# EAGLE design AmbaSat-02-STS21 (EAGLE 9.5.1)
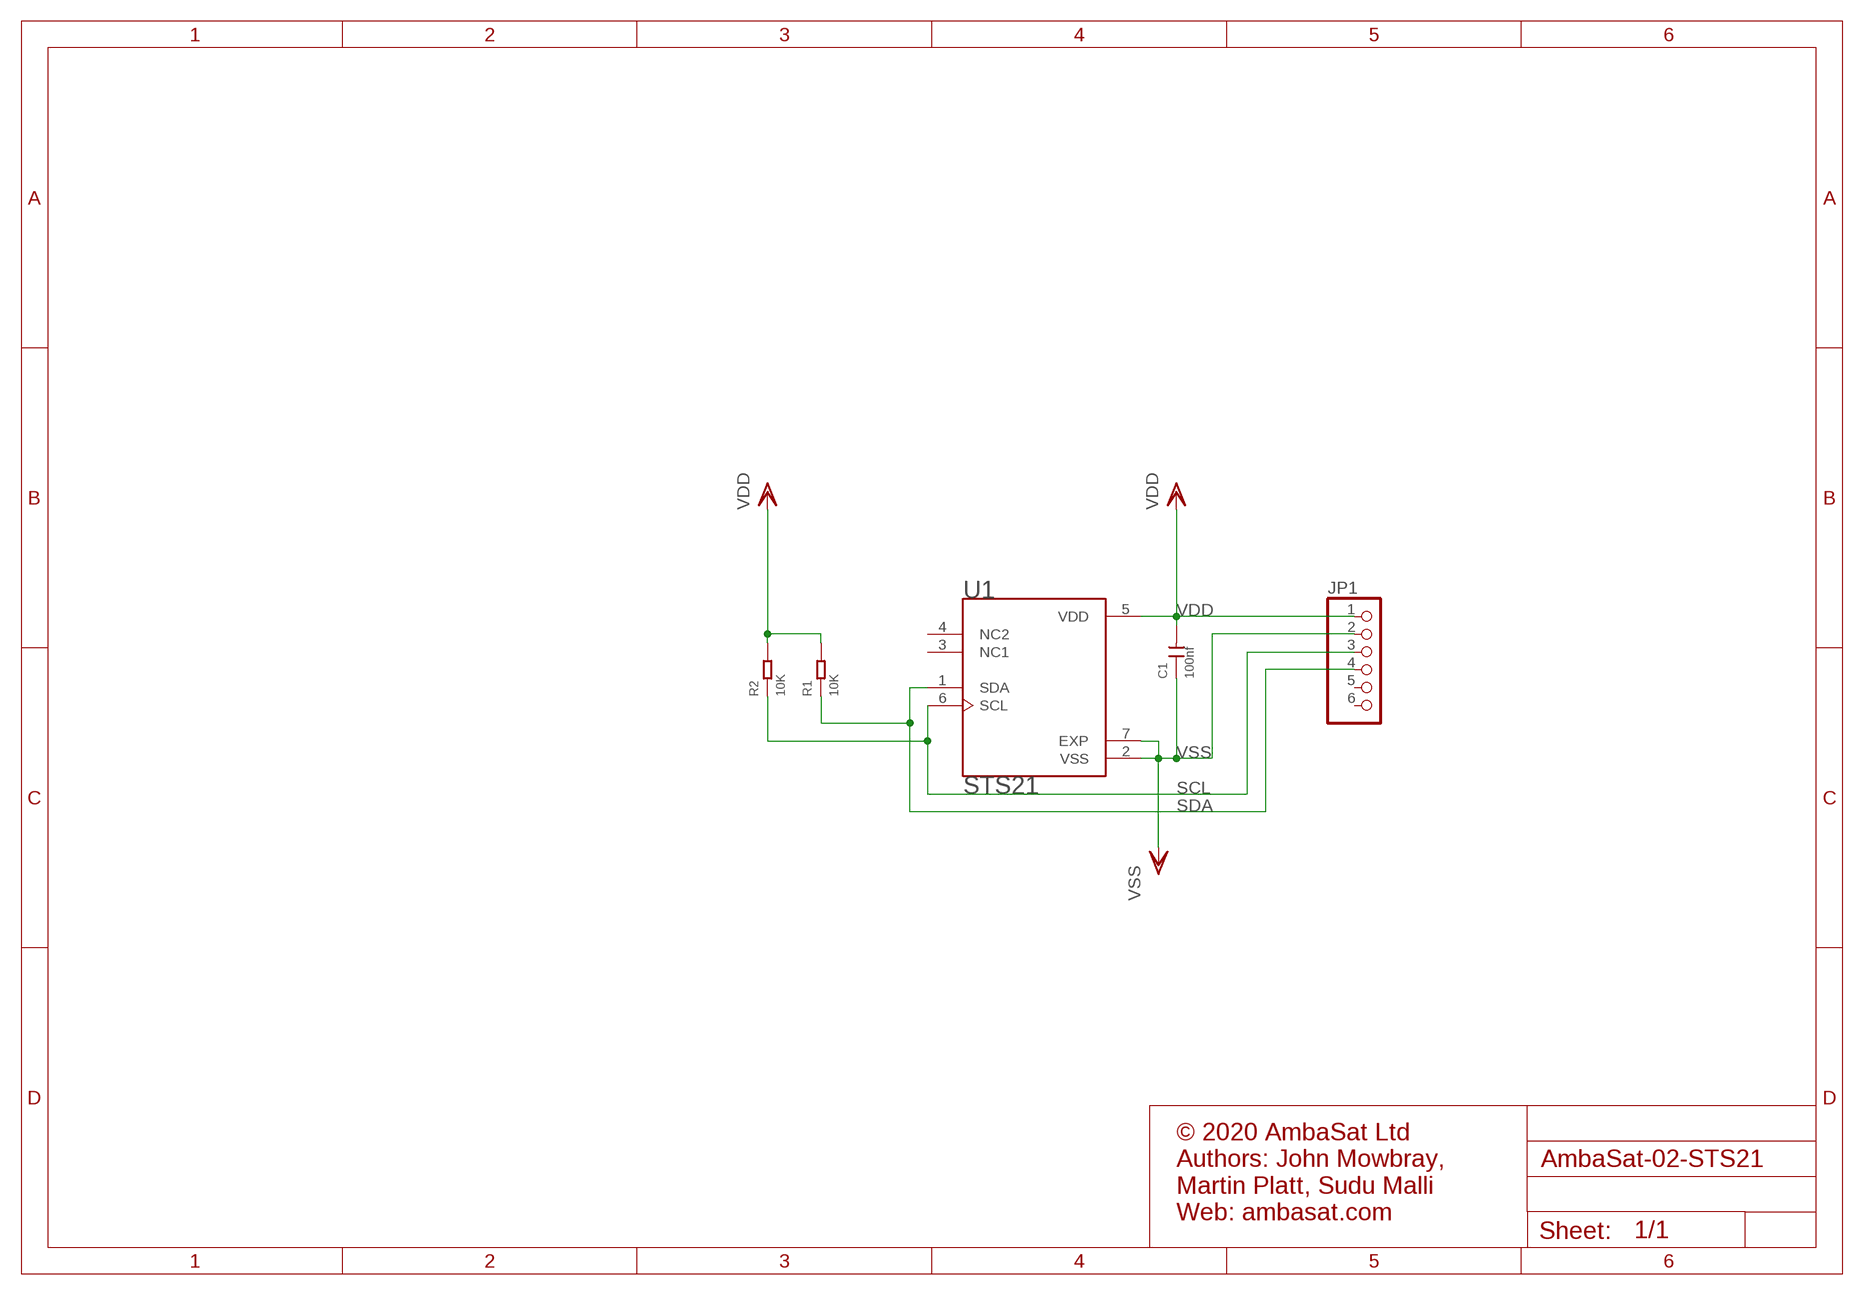
[diagram p0: schematic, sheet 1]

## Parts
C1  100nf  CERAMIC-100NF-50V-10%-X7R(0603)  [C0603]
JP1  HEADER-1X6  [1X06_OVAL]
R1  10K  SMD-RES-10K-1%-1/10W(0603)  [R0603]
R2  10K  SMD-RES-10K-1%-1/10W(0603)  [R0603]
U1  STS21  [XDCR_SGP30-2.5K]

## Nets
SCL: JP1.3 R2.1 U1.6(SCL)
SDA: JP1.4 R1.1 U1.1(SDA)
VDD: C1.2 JP1.1 R1.2 R2.2 U1.5(VDD)
VSS: C1.1 JP1.2 U1.2(VSS) U1.7(EXP)
Unconnected: JP1.5 JP1.6 U1.3(NC1) U1.4(NC2)

## Notes on the sheet
- © 2020 AmbaSat Ltd
  Authors: John Mowbray, 
  Martin Platt, Sudu Malli
  Web: ambasat.com

## Library data of the parts
C1 = Seeed-Capacitor:CERAMIC-100NF-50V-10%-X7R(0603): 302010138; MPN: CC0603KRX7R9BB104
JP1 = microbuilder:HEADER-1X6: PIN HEADER
R1 R2 = Seeed-Resistor:SMD-RES-10K-1%-1/10W(0603): 301010299; MPN: RC0603FR-0710KL
U1 = STS21:STS21: Temperature Sensor Digital, Local -40°C ~ 125°C 14 b 6-DFN (3x3)SENSOR DIGITAL -40C-125C 6DFN; DIGIKEY-PN: 1649-1016-1-ND

## Board
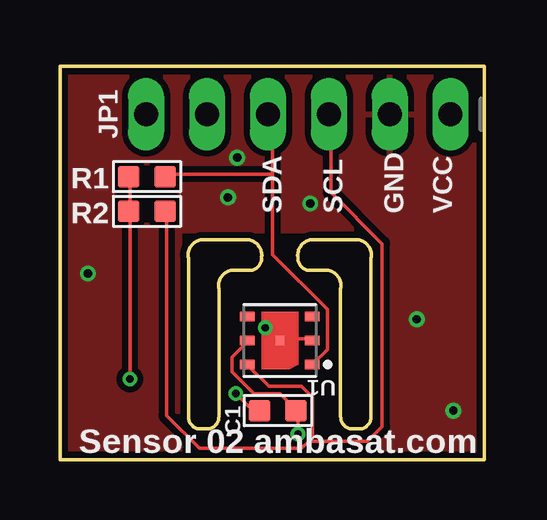
[diagram p1: board, top side]
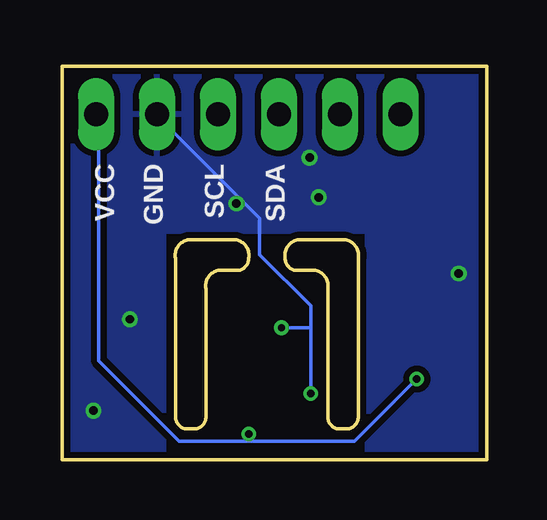
[diagram p2: board, bottom side, seen from below]

Size 17.7 x 16.4 mm. Coordinates in mm from the lower left corner, seen from the top.
Outline: 0,16.4 17.7,16.4 17.7,0 0,0 0,16.4
Outline: 6.63,1.8 arc-90 6.12,1.29 5.86,1.29 arc-90 5.36,1.8 5.36,8.4 arc-90 5.86,9.16 7.9,9.16 arc-90 8.4,8.4 arc-90 7.9,7.89 7.13,7.89 arc90 6.63,7.13 6.63,1.8
Outline: 11.71,1.8 arc90 12.21,1.29 12.47,1.29 arc90 12.98,1.8 12.98,8.4 arc90 12.47,9.16 10.44,9.16 arc90 9.93,8.4 arc90 10.44,7.89 11.2,7.89 arc-90 11.71,7.13 11.71,1.8
Copper layers (1*16): Top 0.035mm / dielectric 1.5mm / Bottom 0.035mm
Design rules "SeeedStudio_2layer_DRU_no_angle_20140221": minimum track width 6mil, minimum drill 12mil, track to track 6mil, track to pad 6mil, pad to pad 6mil, via to via 6mil, smd to smd 0mil, copper to edge 10mil, drill to drill 10mil, minimum pad ring 10mil, minimum via ring 6mil, stop-mask expansion 2mil, vias tented up to drill 100mil, thermal gap 10mil

### Footprints (pad centres in the part's own frame; a part is rotated, then mirrored left to right if it is on the bottom)
C0603 = smd 0.889 x 0.889: 1 0,0.762; 2 0,-0.762
1X06_OVAL = drill 1 long: 1 -6.35,0; 2 -3.81,0; 3 -1.27,0; 4 1.27,0; 5 3.81,0; 6 6.35,0
R0603 = smd 0.889 x 0.889: 1 0,0.762; 2 0,-0.762
XDCR_SGP30-2.5K = smd 0.6 x 0.4: 1 -1.35,1; 2 -1.35,0; 3 -1.35,-1; 4 1.35,-1; 5 1.35,0; 6 1.35,1 | smd 0.35 x 0.4: 7 0,0

### Placement (x,y rotation side)
C1  9.09,2.05 90 top
JP1  9.94,14.4 180 top
R1  3.63,11.8 270 top
R2  3.63,10.36 270 top
U1  9.17,4.97 180 top

### Tracks (layer width: path | path; a pad name or v marks a point on that pad's centre or on a via)
SCL
  Top 0.152: 10.39,0.78 10.08,0.48 5.81,0.48 4.44,1.85 4.44,10.23 R2.1 | 10.39,0.78 10.54,0.93 10.54,2.61 10.08,3.07 8.71,3.07 7.95,3.83 U1.6 | 10.39,0.78 12.82,0.78 13.43,1.39 13.43,9.01 11.3,11.14 11.3,14.34 JP1.3
SDA
  Top 0.152: 8.86,11.91 8.86,14.19 8.71,14.34 JP1.4 | 8.86,11.91 8.86,8.55 11.15,6.27 11.15,4.59 10.54,3.98 U1.1 | 8.86,11.91 4.44,11.91 R1.1
VDD  (via drill 0.3)
  Top 0.152: U1.5 7.79,4.9 7.19,4.29 7.19,3.68 8.1,2.76 9.17,2.76 9.78,2.15 C1.2 9.93,2 v9.93,1.09 | R1.2 2.92,11.75 2.92,10.38 R2.2 2.92,10.23 v2.92,3.37
  Bottom 0.152: v2.92,3.37 5.51,0.78 9.93,0.78 | 9.93,0.78 12.82,0.78 16.18,4.13 16.18,14.34 JP1.1 | 9.93,0.78 v9.93,1.09
VSS  (via drill 0.3, 0.35)
  Top 0.152: 9.17,5.05 10.39,5.05 U1.2 | v7.34,2.76 7.95,2.15 8.25,2.15 C1.1 | 9.17,5.05 8.71,5.5 v8.56,5.5 | 9.17,5.05 U1.7
  Bottom 0.152: 7.34,5.5 7.34,6.42 9.47,8.55 9.47,10.08 13.74,14.34 JP1.2 | 7.34,5.5 v7.34,2.76 | 7.34,5.5 v8.56,5.5
  other vias: 1.17,7.77 7.01,10.94 16.41,2.05 14.88,5.86 10.44,10.69 7.39,12.59
  pour Bottom (isolate 0.254): 0.02,16.4 17.68,16.4 17.68,0.02 13.48,0.02 13.48,9.54 4.98,9.54 4.98,0.02 0.02,0.02
  pour Top (isolate 0.254): 0.02,16.4 17.68,16.4 17.68,0.02 13.48,0.02 13.48,9.54 4.98,9.54 4.98,0.02 0.02,0.02

### Text on the board
tPlace: SDA | SCL | GND | VCC | Sensor 02 ambasat.com
bPlace: SDA | SCL | GND | VCC